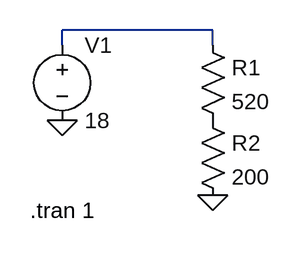
[diagram p0: schematic 18V_to_5V.asc]
18V_to_5V.asc, the LTspice schematic file:
Version 4
SHEET 1 880 680
WIRE 208 80 48 80
WIRE 48 96 48 80
WIRE 208 96 208 80
FLAG 48 176 0
FLAG 208 256 0
SYMBOL voltage 48 80 R0
WINDOW 123 0 0 Left 0
WINDOW 39 0 0 Left 0
SYMATTR InstName V1
SYMATTR Value 18
SYMBOL res 192 80 R0
SYMATTR InstName R1
SYMATTR Value 520
SYMBOL res 192 160 R0
SYMATTR InstName R2
SYMATTR Value 200
TEXT 14 272 Left 2 !.tran 1

The netlist it stands for:
* 18V_to_5V.asc
V1 N001 0 18
R1 N001 P001 520
R2 P001 0 200
.tran 1
.backanno
.end